# EAGLE schematic OBCv4.24 (EAGLE 9.6.2)

## Sheet 1 of 3
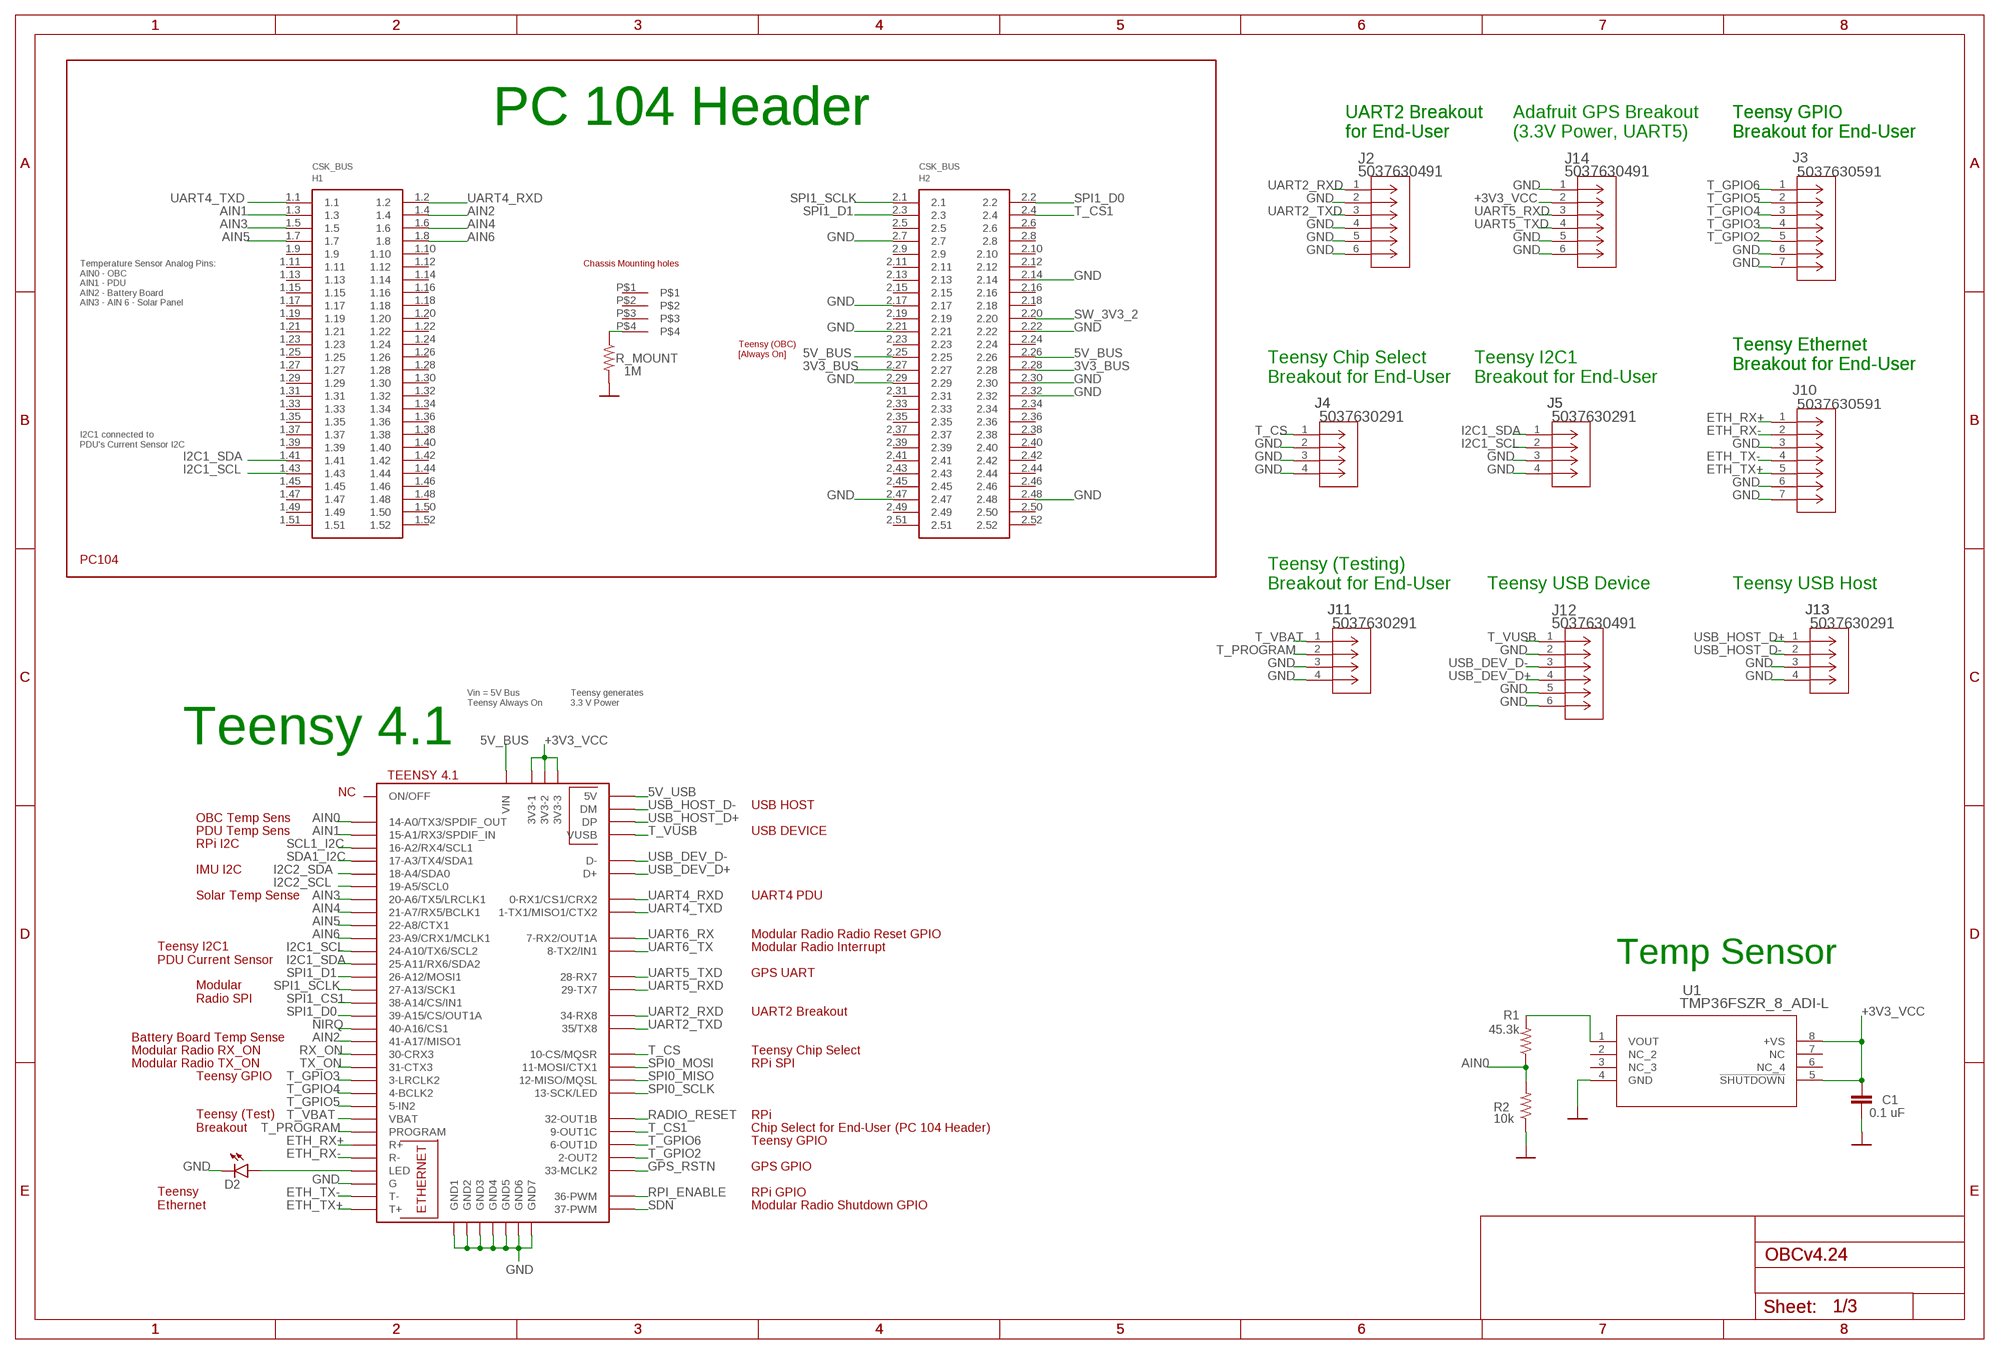
[diagram p0: schematic, sheet 1]

### Parts
C1  0.1 uF  CAP0805  [0805]
D2  LEDCHIP-LED0603  [CHIP-LED0603]
H1  PC104_WCONN  [PC104_WCONN]
J2  5037630491  [CON_5037630491]
J3  5037630591  [CON_5037630591]
J4  5037630291  [CON_5037630291]
J5  5037630291  [CON_5037630291]
J10  5037630591  [CON_5037630591]
J11  5037630291  [CON_5037630291]
J12  5037630491  [CON_5037630491]
J13  5037630291  [CON_5037630291]
J14  5037630491  [CON_5037630491]
R1  45.3k  RESISTOR0805-RES  [0805]
R2  10k  RESISTOR0805-RES  [0805]
R_MOUNT  1M  RESISTOR0805-RES  [0805]
U1  TMP36FSZR_8_ADI-L  [R_8_ADI-L]
U$1  TEENSY41TEENSY  [TEENSY41]

### Nets
3V3_BUS: H1.2.27 H1.2.28 ; also sheet 3
5V_BUS: H1.2.25 H1.2.26 U$1.VIN ; also sheet 2
5V_USB: U$1.+5V(5V)
+3V3_VCC: C1.1 J14.2 U1.5(!SHUTDOWN) U1.8(+VS) U$1.3V3-1 U$1.3V3-2 U$1.3V3-3 ; also sheet 3
AIN0: R1.1 R2.2 U$1.14-A0/TX3/SPDIF_OUT
AIN1: H1.1.3 U$1.15-A1/RX3/SPDIF_IN
AIN2: H1.1.4 U$1.41-A17/MISO1
AIN3: H1.1.5 U$1.20-A6/TX5/LRCLK1
AIN4: H1.1.6 U$1.21-A7/RX5/BCLK1
AIN5: H1.1.7 U$1.22-A8/CTX1
AIN6: H1.1.8 U$1.23-A9/CRX1/MCLK1
ETH_RX+: J10.1 U$1.R+
ETH_RX-: J10.2 U$1.R-
ETH_TX+: J10.5 U$1.T+
ETH_TX-: J10.4 U$1.T-
GND: C1.2 D2.C H1.2.7 H1.2.14 H1.2.17 H1.2.21 H1.2.22 H1.2.29 H1.2.30 H1.2.32 H1.2.47 H1.2.48 J2.2 J2.4 J2.5 J2.6 J3.6 J3.7 J4.2 J4.3 J4.4 J5.3 J5.4 J10.3 J10.6 J10.7 J11.3 J11.4 J12.2 J12.5 J12.6 J13.3 J13.4 J14.1 J14.5 J14.6 R2.1 R_MOUNT.2 U1.4(GND) U$1.G U$1.GND1 U$1.GND2 U$1.GND3 U$1.GND4 U$1.GND5 U$1.GND6 U$1.GND(GND7) ; also sheet 2,3
GPS_RSTN: U$1.33-MCLK2 ; also sheet 3
I2C1_SCL: H1.1.43 J5.2 U$1.24-A10/TX6/SCL2
I2C1_SDA: H1.1.41 J5.1 U$1.25-A11/RX6/SDA2
I2C2_SCL: U$1.19-A5/SCL0 ; also sheet 3
I2C2_SDA: U$1.18-A4/SDA0 ; also sheet 3
N$8: D2.A U$1.LED
N$15: R1.2 U1.1(VOUT)
N$94: H1.P$4 R_MOUNT.1
NIRQ: U$1.40-A16/CS1 ; also sheet 3
RADIO_RESET: U$1.32-OUT1B ; also sheet 3
RPI_ENABLE: U$1.36-PWM ; also sheet 2
RX_ON: U$1.30-CRX3 ; also sheet 3
SCL1_I2C: U$1.16-A2/RX4/SCL1 ; also sheet 2
SDA1_I2C: U$1.17-A3/TX4/SDA1 ; also sheet 2
SDN: U$1.37-PWM ; also sheet 3
SPI0_MISO: U$1.12-MISO/MQSL ; also sheet 2
SPI0_MOSI: U$1.11-MOSI/CTX1 ; also sheet 2
SPI0_SCLK: U$1.13-SCK/LED ; also sheet 2
SPI1_CS1: U$1.38-A14/CS/IN1 ; also sheet 3
SPI1_D0: H1.2.2 U$1.39-A15/CS/OUT1A ; also sheet 3
SPI1_D1: H1.2.3 U$1.26-A12/MOSI1 ; also sheet 3
SPI1_SCLK: H1.2.1 U$1.27-A13/SCK1 ; also sheet 3
SW_3V3_2: H1.2.20 ; also sheet 3
T_CS: J4.1 U$1.10-CS\MQSR(10-CS/MQSR)
T_CS1: H1.2.4 U$1.9-OUT1C
T_GPIO2: J3.5 U$1.2-OUT2
T_GPIO3: J3.4 U$1.3-LRCLK2
T_GPIO4: J3.3 U$1.4-BCLK2
T_GPIO5: J3.2 U$1.5-IN2
T_GPIO6: J3.1 U$1.6-OUT1D
T_PROGRAM: J11.2 U$1.PROGRAM
T_VBAT: J11.1 U$1.VBAT
T_VUSB: J12.1 U$1.VUSB
TX_ON: U$1.31-CTX3 ; also sheet 3
UART2_RXD: J2.1 U$1.34-RX8
UART2_TXD: J2.3 U$1.35-TX8(35/TX8)
UART4_RXD: H1.1.2 U$1.0-RX1/CS1/CRX2
UART4_TXD: H1.1.1 U$1.1-TX1/MISO1/CTX2
UART5_RXD: J14.3 U$1.29-TX7 ; also sheet 3
UART5_TXD: J14.4 U$1.28-RX7 ; also sheet 3
UART6_RX: U$1.7-RX2/OUT1A ; also sheet 2
UART6_TX: U$1.8-TX2/IN1 ; also sheet 2
USB_DEV_D+: J12.4 U$1.D+
USB_DEV_D-: J12.3 U$1.D-
USB_HOST_D+: J13.1 U$1.DP
USB_HOST_D-: J13.2 U$1.DM
Unconnected: H1.1.9 H1.1.10 H1.1.11 H1.1.12 H1.1.13 H1.1.14 H1.1.15 H1.1.16 H1.1.17 H1.1.18 H1.1.19 H1.1.20 H1.1.21 H1.1.22 H1.1.23 H1.1.24 H1.1.25 H1.1.26 H1.1.27 H1.1.28 H1.1.29 H1.1.30 H1.1.31 H1.1.32 H1.1.33 H1.1.34 H1.1.35 H1.1.36 H1.1.37 H1.1.38 H1.1.39 H1.1.40 H1.1.42 H1.1.44 H1.1.45 H1.1.46 H1.1.47 H1.1.48 H1.1.49 H1.1.50 H1.1.51 H1.1.52 H1.2.5 H1.2.6 H1.2.8 H1.2.9 H1.2.10 H1.2.11 H1.2.12 H1.2.13 H1.2.15 H1.2.16 H1.2.18 H1.2.19 H1.2.23 H1.2.24 H1.2.31 H1.2.33 H1.2.34 H1.2.35 H1.2.36 H1.2.37 H1.2.38 H1.2.39 H1.2.40 H1.2.41 H1.2.42 H1.2.43 H1.2.44 H1.2.45 H1.2.46 H1.2.49 H1.2.50 H1.2.51 H1.2.52 H1.P$1 H1.P$2 H1.P$3 U1.2(NC_2) U1.3(NC_3) U1.6(NC_4) U1.7(NC) U$1.ON/OFF

### Notes on the sheet
- PC 104 Header | PC 104 Header
- UART2 Breakout
  for End-User
- UART2 Breakout
  for End-User
- Adafruit GPS Breakout 
  (3.3V Power, UART5)
- Teensy GPIO
  Breakout for End-User
- Teensy GPIO
  Breakout for End-User
- Temperature Sensor Analog Pins:
  AIN0 - OBC
  AIN1 - PDU
  AIN2 - Battery Board
  AIN3 - AIN 6 - Solar Panel
- Teensy (OBC)
  [Always On]
- Teensy Ethernet
  Breakout for End-User
- Teensy Ethernet
  Breakout for End-User
- Teensy Chip Select
  Breakout for End-User
- Teensy I2C1 
  Breakout for End-User
- I2C1 connected to
  PDU's Current Sensor I2C
- Teensy (Testing)
  Breakout for End-User
- Teensy USB Device | Teensy USB Host
- Vin = 5V Bus 
  Teensy Always On
- Teensy generates 
  3.3 V Power
- Teensy 4.1
- NC
- USB HOST
- OBC Temp Sens
- PDU Temp Sens | USB DEVICE
- RPi I2C
- IMU I2C
- Solar Temp Sense | UART4 PDU
- Modular Radio Radio Reset GPIO
- Modular Radio Interrupt
- Teensy I2C1
  PDU Current Sensor
- Temp Sensor
- GPS UART
- Modular 
  Radio SPI
- UART2 Breakout
- Battery Board Temp Sense
- Modular Radio RX_ON | Teensy Chip Select
- Modular Radio TX_ON | RPi SPI
- Teensy GPIO
- RPi
- Teensy (Test)
  Breakout
- Chip Select for End-User (PC 104 Header)
- Teensy GPIO
- GPS GPIO
- RPi GPIO
- Teensy 
  Ethernet
- Modular Radio Shutdown GPIO

## Sheet 2 of 3
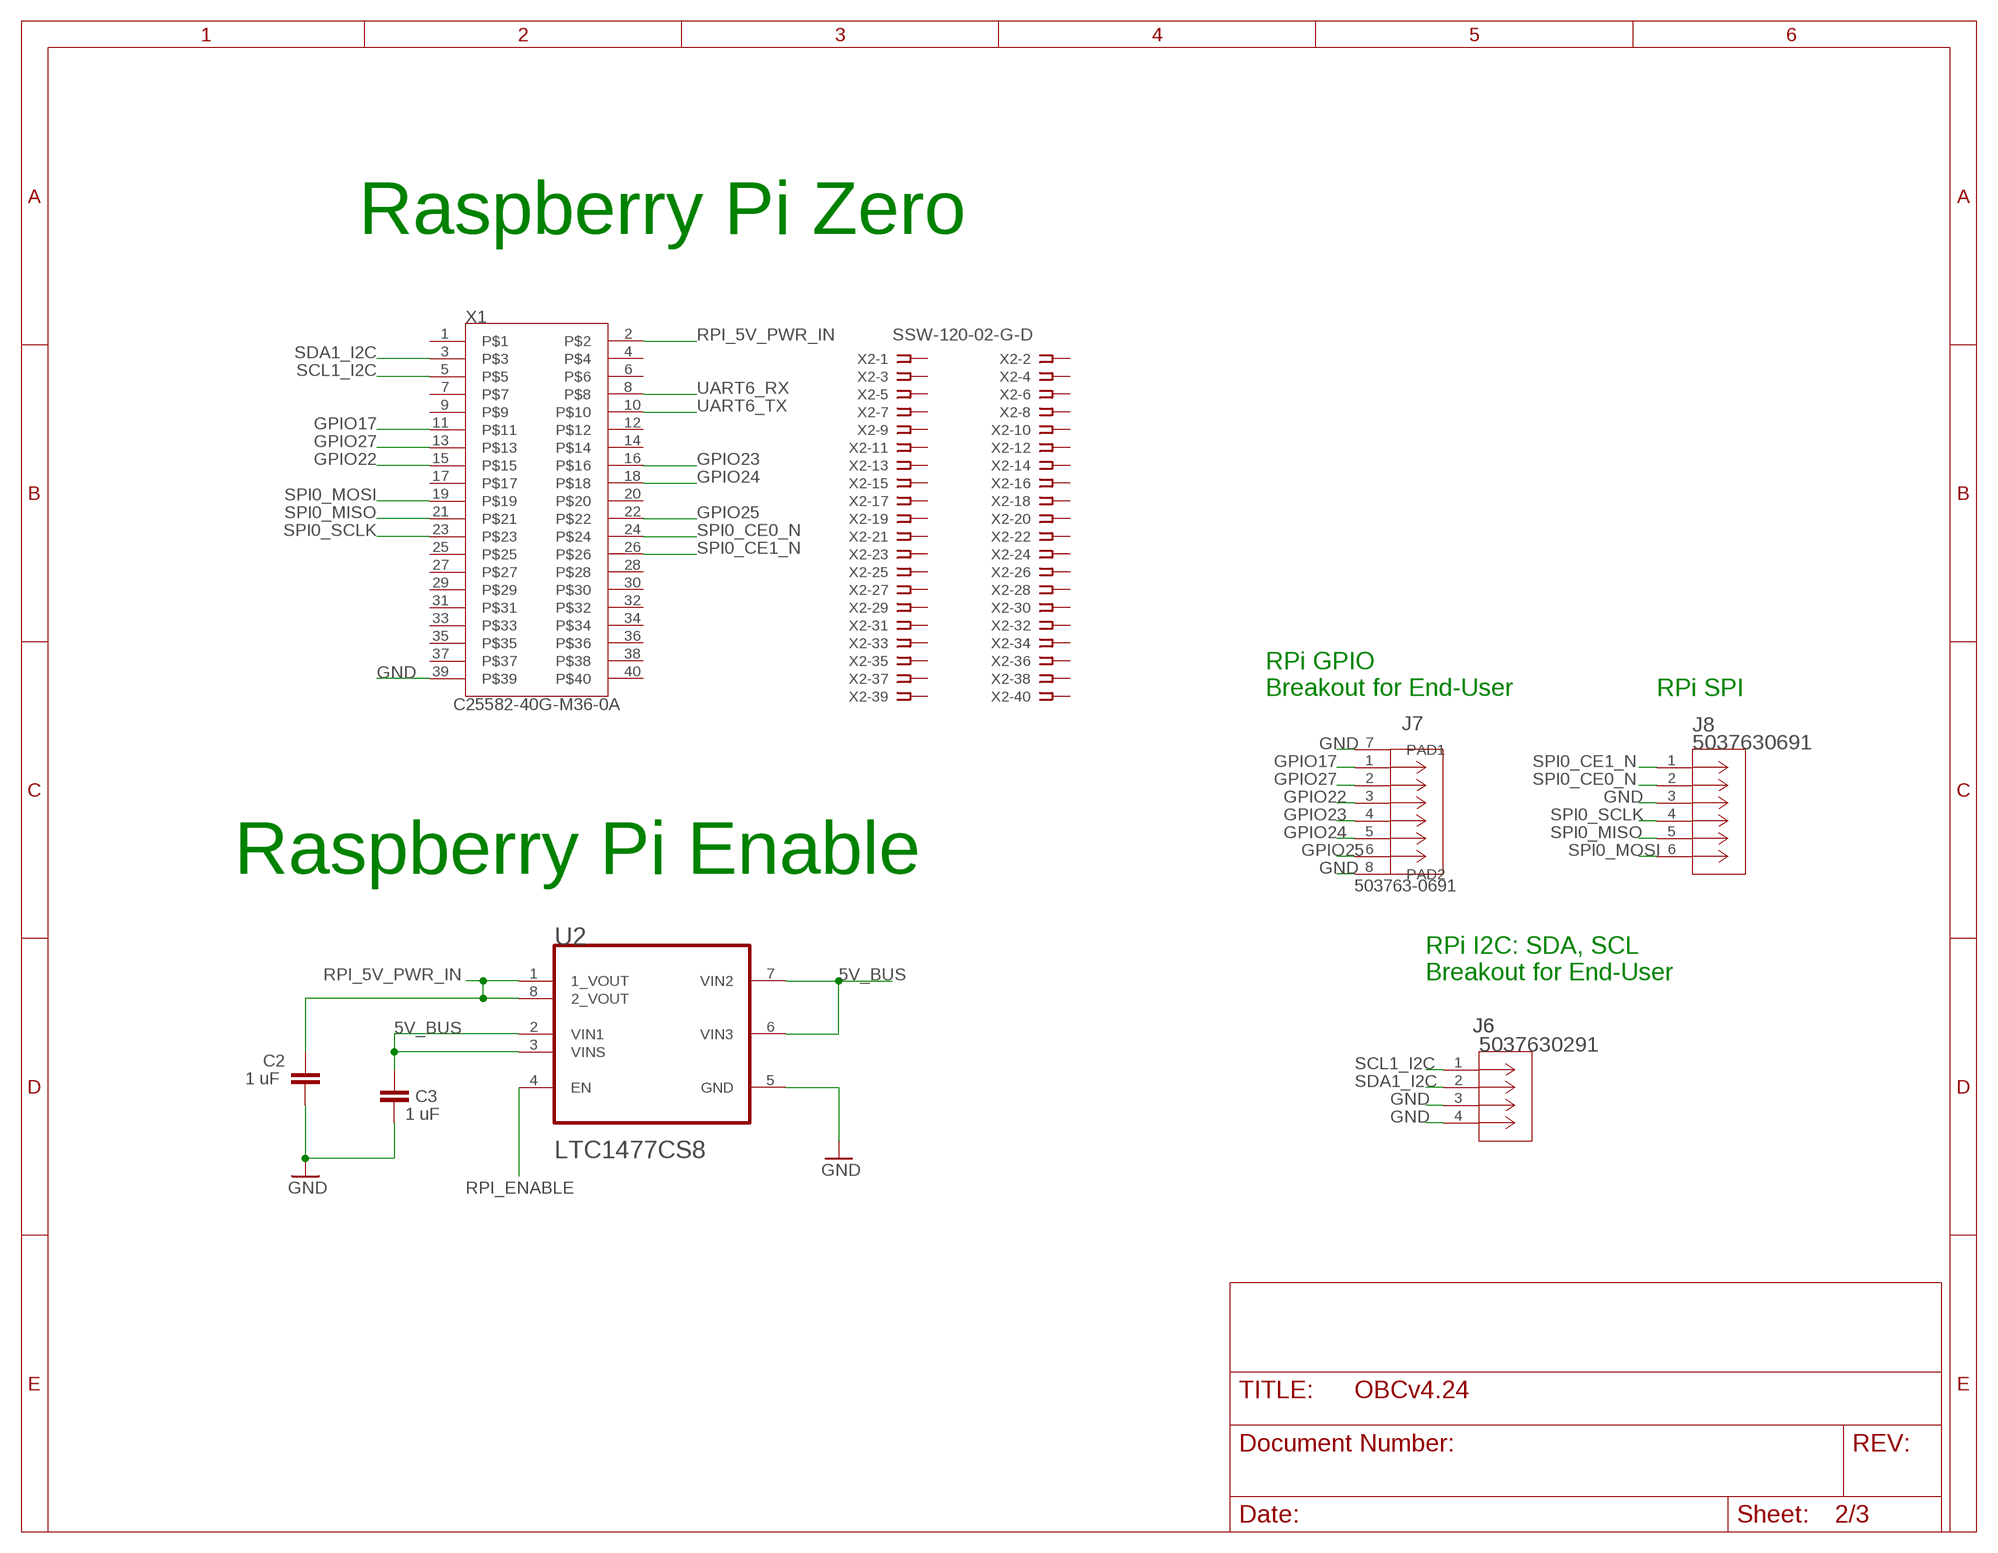
[diagram p1: schematic, sheet 2]

### Parts
C2  1 uF  CAP0805  [0805]
C3  1 uF  CAP0805  [0805]
J6  5037630291  [CON_5037630291]
J7  503763-0691  [CONN_503763-0691_MOL]
J8  5037630691  [CONN_503763-0691_MOL]
U2  LTC1477CS8LINEAR_TECHNOLOGY_LTC1477CS8_0_2  [LINEAR_TECHNOLOGY_LTC1477CS8_2]
X1  C25582-40G-M36-0A  [ADAFRUIT_C25582-40G-M36-0A_0]
X2  SSW-120-02-G-D  [SSW-120-02-G-D]

### Nets
5V_BUS: C3.1 U2.2(VIN1) U2.3(VINS) U2.6(VIN3) U2.7(VIN2) ; also sheet 1
GND: C2.2 C3.2 J6.3 J6.4 J7.7(PAD1) J7.8(PAD2) J8.3 U2.5(GND) X1.39 ; also sheet 1,3
GPIO17: J7.1 X1.11
GPIO22: J7.3 X1.15
GPIO23: J7.4 X1.16
GPIO24: J7.5 X1.18
GPIO25: J7.6 X1.22
GPIO27: J7.2 X1.13
RPI_5V_PWR_IN: C2.1 U2.1(1_VOUT) U2.8(2_VOUT) X1.2
RPI_ENABLE: U2.4(EN) ; also sheet 1
SCL1_I2C: J6.1 X1.5 ; also sheet 1
SDA1_I2C: J6.2 X1.3 ; also sheet 1
SPI0_CE0_N: J8.2 X1.24
SPI0_CE1_N: J8.1 X1.26
SPI0_MISO: J8.5 X1.21 ; also sheet 1
SPI0_MOSI: J8.6 X1.19 ; also sheet 1
SPI0_SCLK: J8.4 X1.23 ; also sheet 1
UART6_RX: X1.8 ; also sheet 1
UART6_TX: X1.10 ; also sheet 1
Unconnected: X1.1 X1.4 X1.6 X1.7 X1.9 X1.12 X1.14 X1.17 X1.20 X1.25 X1.27 X1.28 X1.29 X1.30 X1.31 X1.32 X1.33 X1.34 X1.35 X1.36 X1.37 X1.38 X1.40 X2.1 X2.2 X2.3 X2.4 X2.5 X2.6 X2.7 X2.8 X2.9 X2.10 X2.11 X2.12 X2.13 X2.14 X2.15 X2.16 X2.17 X2.18 X2.19 X2.20 X2.21 X2.22 X2.23 X2.24 X2.25 X2.26 X2.27 X2.28 X2.29 X2.30 X2.31 X2.32 X2.33 X2.34 X2.35 X2.36 X2.37 X2.38 X2.39 X2.40

### Notes on the sheet
- Raspberry Pi Zero
- RPi GPIO
  Breakout for End-User
- RPi SPI
- Raspberry Pi Enable
- RPi I2C: SDA, SCL 
  Breakout for End-User

## Sheet 3 of 3
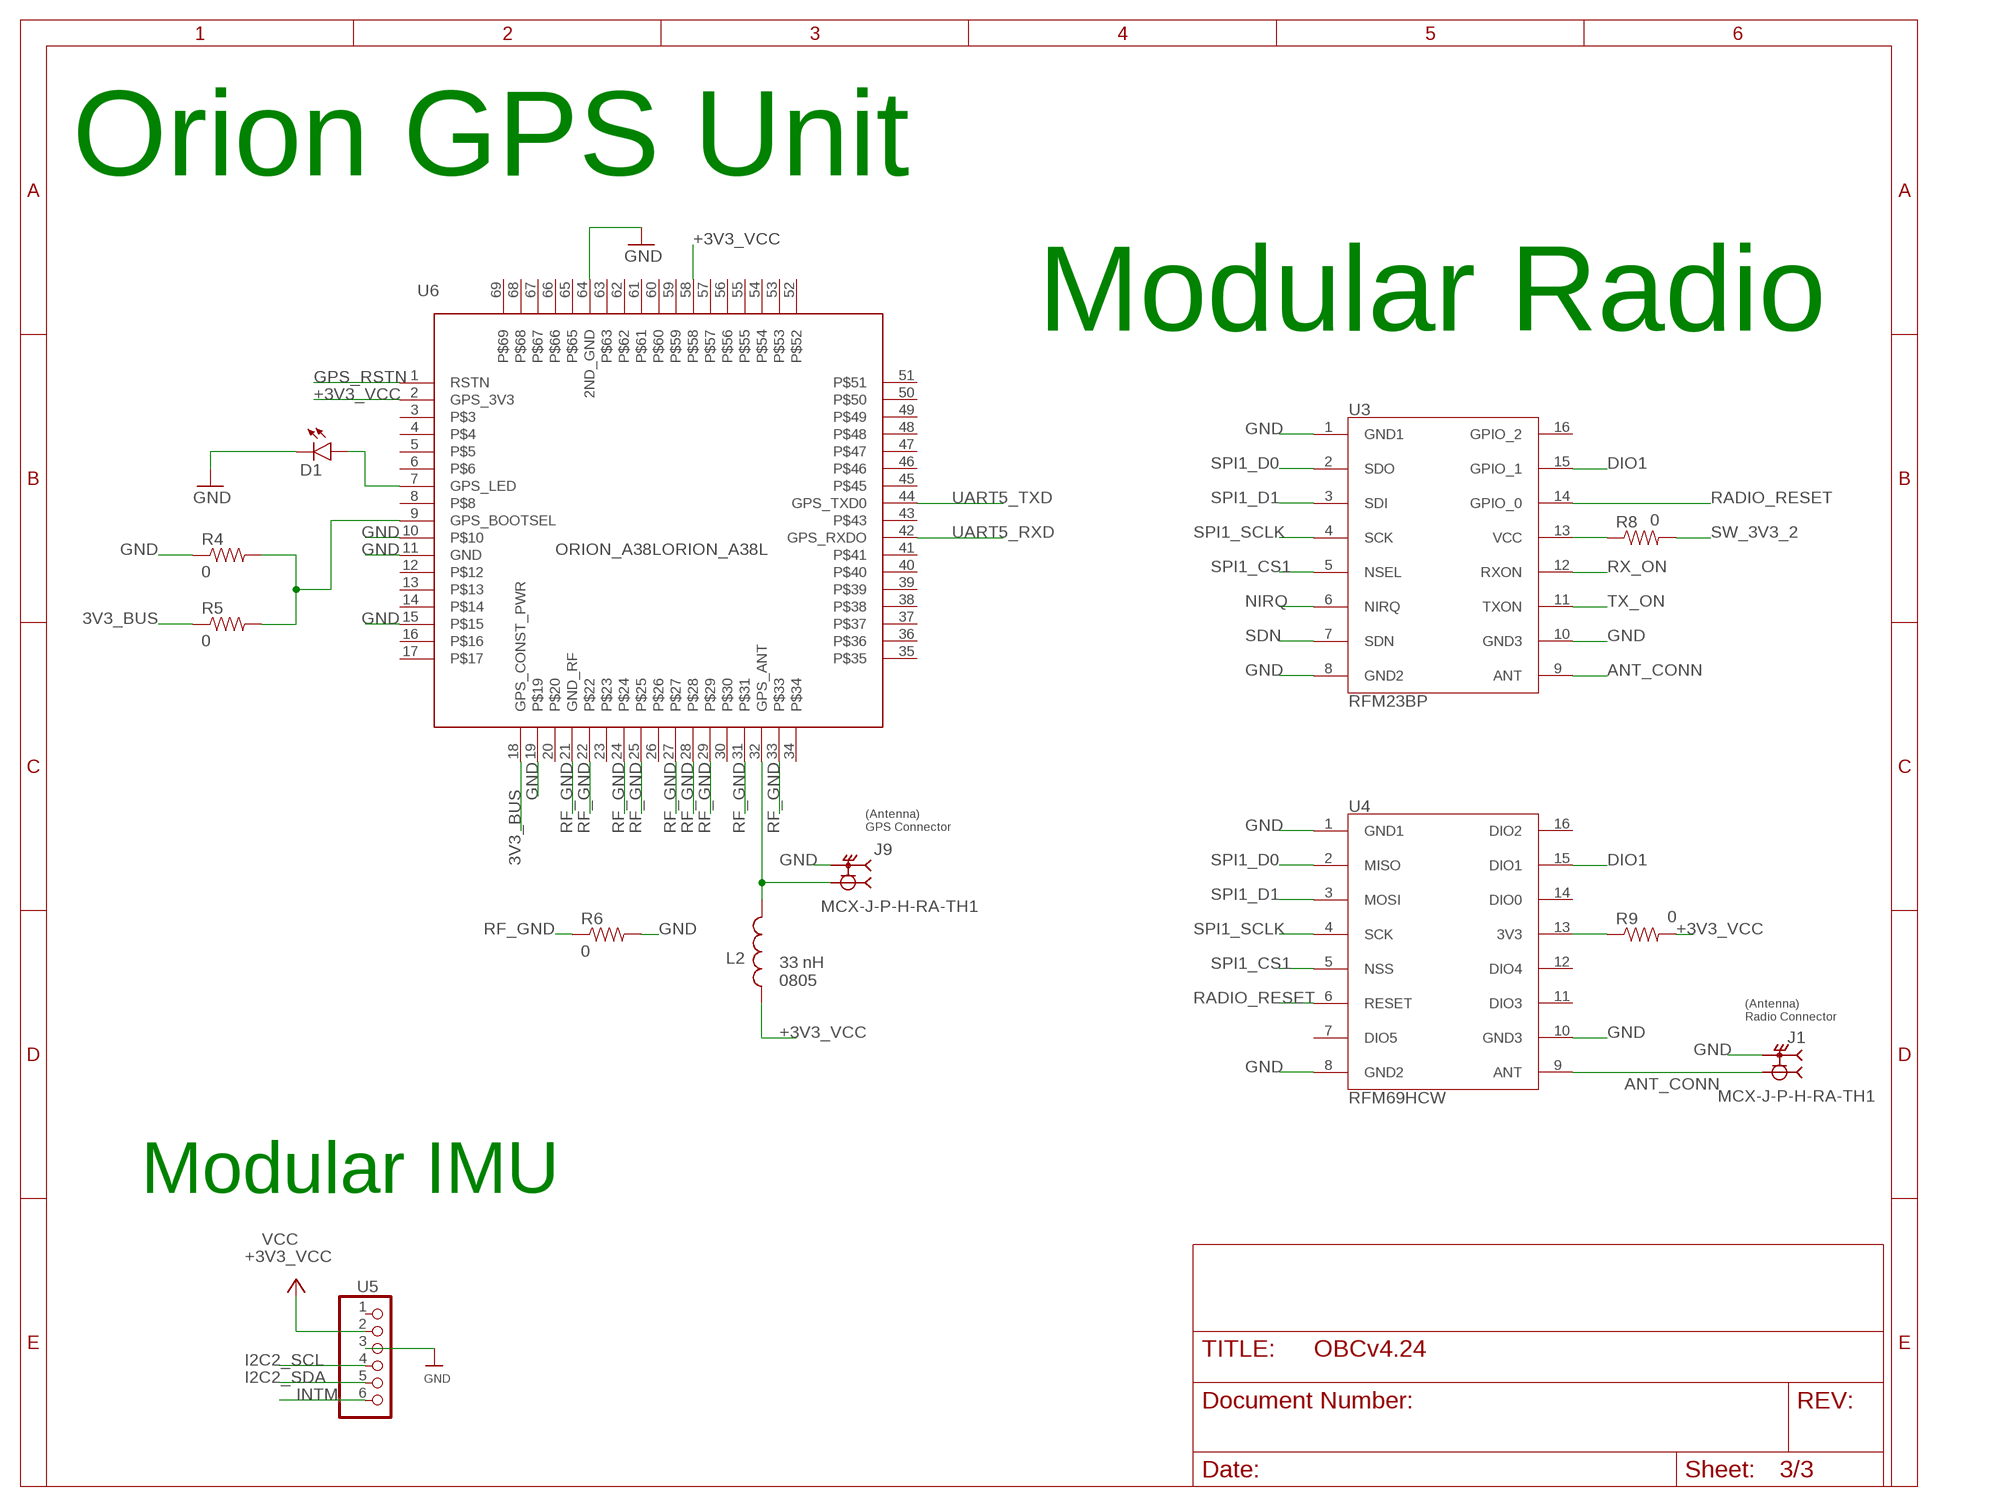
[diagram p2: schematic, sheet 3]

### Parts
D1  LEDCHIP-LED0603  [CHIP-LED0603]
J1  MCX-J-P-H-RA-TH1  [SAMTEC_MCX-J-P-H-RA-TH1]
J9  MCX-J-P-H-RA-TH1  [SAMTEC_MCX-J-P-H-RA-TH1]
L2  AIMC-0805-2N2S-T  [INDC2012X105N]
R4  0  RESISTOR0805-RES  [0805]
R5  0  RESISTOR0805-RES  [0805]
R6  0  RESISTOR0805-RES  [0805]
R8  0  RESISTOR2512  [R2512]
R9  0  RESISTOR2512  [R2512]
U3  RFM23BP  [RFM23BP]
U4  RFM69HCW  [RFM69HCW]
U5  HEADER-1X670MIL  [1X06_ROUND_70]
U6  ORION_A38LORION_A38L  [ORION_A38L]

### Nets
3V3_BUS: R5.1 U6.18(GPS_CONST_PWR) ; also sheet 1
+3V3_VCC: L2.1 R9.2 U5.2 U6.2(GPS_3V3) U6.58 ; supply symbol labelled VCC ; also sheet 1
ANT_CONN: J1.1 U3.9(ANT) U4.9(ANT)
DIO1: U3.15(GPIO_1) U4.15(DIO1)
GND: D1.C J1.S1 J1.S2 J1.S3 J1.S4 J9.S1 J9.S2 J9.S3 J9.S4 R4.1 R6.2 U3.1(GND1) U3.8(GND2) U3.10(GND3) U4.1(GND1) U4.8(GND2) U4.10(GND3) U5.3 U6.10 U6.11(GND) U6.15 U6.19 U6.64(2ND_GND) ; also sheet 1,2
GPS_RSTN: U6.1(RSTN) ; also sheet 1
I2C2_SCL: U5.4 ; also sheet 1
I2C2_SDA: U5.5 ; also sheet 1
INTM: U5.6
N$9: R8.1 U3.13(VCC)
N$10: R9.1 U4.13(3V3)
N$16: R4.2 R5.2 U6.9(GPS_BOOTSEL)
N$17: J9.1 L2.2 U6.32(GPS_ANT)
N$21: D1.A U6.7(GPS_LED)
NIRQ: U3.6(NIRQ) ; also sheet 1
RADIO_RESET: U3.14(GPIO_0) U4.6(RESET) ; also sheet 1
RF_GND: R6.1 U6.21(GND_RF) U6.22 U6.24 U6.25 U6.27 U6.28 U6.29 U6.31 U6.33
RX_ON: U3.12(RXON) ; also sheet 1
SDN: U3.7(SDN) ; also sheet 1
SPI1_CS1: U3.5(NSEL) U4.5(NSS) ; also sheet 1
SPI1_D0: U3.2(SDO) U4.2(MISO) ; also sheet 1
SPI1_D1: U3.3(SDI) U4.3(MOSI) ; also sheet 1
SPI1_SCLK: U3.4(SCK) U4.4(SCK) ; also sheet 1
SW_3V3_2: R8.2 ; also sheet 1
TX_ON: U3.11(TXON) ; also sheet 1
UART5_RXD: U6.42(GPS_RXDO) ; also sheet 1
UART5_TXD: U6.44(GPS_TXD0) ; also sheet 1
Unconnected: U3.16(GPIO_2) U4.7(DIO5) U4.11(DIO3) U4.12(DIO4) U4.14(DIO0) U4.16(DIO2) U5.1 U6.3 U6.4 U6.5 U6.6 U6.8 U6.12 U6.13 U6.14 U6.16 U6.17 U6.20 U6.23 U6.26 U6.30 U6.34 U6.35 U6.36 U6.37 U6.38 U6.39 U6.40 U6.41 U6.43 U6.45 U6.46 U6.47 U6.48 U6.49 U6.50 U6.51 U6.52 U6.53 U6.54 U6.55 U6.56 U6.57 U6.59 U6.60 U6.61 U6.62 U6.63 U6.65 U6.66 U6.67 U6.68 U6.69

### Notes on the sheet
- Orion GPS Unit
- Modular Radio
- (Antenna)
  GPS Connector
- 33 nH
  0805
- (Antenna)
  Radio Connector
- Modular IMU

## Library data of the parts
C1-C3 = HSFL_Main_Library:CAP: Capacitor Standard 0603 ceramic capacitor, and 0.1" leaded capacitor.
D1 D2 = led:LED: LED OSRAM: - CHIPLED LG R971, LG N971, LY N971, LG Q971, LY Q971, LO R971, LY R971 LH N974, LH R974 LS Q976, LO Q976, LY Q976 LO Q996 - Hyper CHIPLED LW Q18S LB Q993, LB Q99A, LB R99A - SideLED LS A670, LO A670, LY A670, LG A670, LP A670 LB A673, LV A673, LT A673, LW A673 LH A674 LY A675 LS A676, LA A676, LO A676, LY A676, LW A676 LS A679, LY A679, LG A679 - Hyper Micro SIDELED® LS Y876, LA Y876, LO Y876, LY Y876 LT Y87S - SmartLED LW L88C, LW L88S LB L89C, LB L89S, LG L890 LS L89K, LO L89K, LY L89K LS L896, LA L896, LO L896, LY L896 - TOPLED LS T670, LO T670, LY T670, LG T670, LP T670 LSG T670, LSP T670, LSY T670, LOP T670, LYG T670 LG T671, LOG T671, LSG T671 LB T673, LV T673, LT T673, LW T673 LH T674 LS T676, LA T676, LO T676, LY T676, LB T676, LH T676, LSB T676, LW T676 LB T67C, LV T67C, LT T67C, LS T67K, LO T67K, LY T67K, LW E67C LS E67B, LA E67B, LO E67B, LY E67B, LB E67C, LV E67C, LT E67C LW T67C LS T679, LY T679, LG T679 LS T770, LO T770, LY T770, LG T770, LP T770 LB T773, LV T773, LT T773, LW T773 LH T774 LS E675, LA E675, LY E675, LS T675 LS T776, LA T776, LO T776, LY T776, LB T776 LHGB T686 LT T68C, LB T68C - Hyper Mini TOPLED® LB M676 - Mini TOPLED Santana® LG M470 LS M47K, LO M47K, LY M47K Source: http://www.osram.convergy.de LUXEON: - LUMILED® LXK2-PW12-R00, LXK2-PW12-S00, LXK2-PW14-U00, LXK2-PW14-V00 LXK2-PM12-R00, LXK2-PM12-S00, LXK2-PM14-U00 LXK2-PE12-Q00, LXK2-PE12-R00, LXK2-PE12-S00, LXK2-PE14-T00, LXK2-PE14-U00 LXK2-PB12-K00, LXK2-PB12-L00, LXK2-PB12-M00, LXK2-PB14-N00, LXK2-PB14-P00, LXK2-PB14-Q00 LXK2-PR12-L00, LXK2-PR12-M00, LXK2-PR14-Q00, LXK2-PR14-R00 LXK2-PD12-Q00, LXK2-PD12-R00, LXK2-PD12-S00 LXK2-PH12-R00, LXK2-PH12-S00 LXK2-PL12-P00, LXK2-PL12-Q00, LXK2-PL12-R00 Source: www.luxeon.com KINGBRIGHT: KA-3528ASYC Source: www.kingbright.com
H1 = HSFL_Main_Library:PC104_WCONN
J1 J9 = OBCv4:MCX-J-P-H-RA-TH1: 50 Ohm MCX Jack or Plug, Through-hole; DESCRIPTION: MCX Connector Jack, Female Socket 50Ohm Through Hole, Right Angle Solder; DIGI-KEY_PART_NUMBER: SAM10607-ND; MF: Samtec; MP: MCX-J-P-H-RA-TH1; PACKAGE: None; PURCHASE-URL: https://pricing.snapeda.com/search/part/MCX-J-P-H-RA-TH1/?ref=eda
J2 J12 J14 = OBCv4:5037630491; BUILT_BY: Molex_Team; COPYRIGHT: Copyright (C) 2018 Accelerated Designs. All rights reserved; MANUFACTURER_PART_NUMBER: 5037630491; SOURCELIBRARY: Add_to_database_2021-03-17; VENDOR: Molex Connector Corporation
J3 J10 = OBCv4:5037630591; COPYRIGHT: Copyright (C) 2021 Ultra Librarian. All rights reserved.; MANUFACTURER_PART_NUMBER: 5037630591; MFR_NAME: Molex Connector Corporation
J4-J6 J11 J13 = OBCv4:5037630291; BUILT_BY: Molex_Team; COPYRIGHT: Copyright (C) 2018 Accelerated Designs. All rights reserved; MANUFACTURER_PART_NUMBER: 5037630291; SOURCELIBRARY: Add_to_database_2021-03-17; VENDOR: Molex Connector Corporation
J7 = Improved Molex 503763-0691:503763-0691; BUILT_BY: EMA_Cory; COPYRIGHT: Copyright (C) 2018 Accelerated Designs. All rights reserved; DATASHEET: https://www.digikey.com/products/en?keywords=503763-0691; MANUFACTURER_PART_NUMBER: 503763-0691; SOURCELIBRARY: Molex_2020-01-22; VENDOR: Molex Connector Corporation
J8 = OBCv4:5037630691; BUILT_BY: EMA_Cory; COPYRIGHT: Copyright (C) 2018 Accelerated Designs. All rights reserved; DATASHEET: https://www.digikey.com/products/en?keywords=503763-0691; MANUFACTURER_PART_NUMBER: 503763-0691; SOURCELIBRARY: Molex_2020-01-22; VENDOR: Molex Connector Corporation
L2 = PDU:AIMC-0805-2N2S-T: 2.2nH Unshielded Multilayer Inductor 600mA 100mOhm Max 0805 (2012 Metric); DESCRIPTION: IND 2.2nH 0.3A 100mΩ; DIGI-KEY_PART_NUMBER: 535-11562-1-ND; MF: Abracon; MP: AIMC-0805-2N2S-T; PACKAGE: 2012 Bourns
R1 R2 R4-R6 R8 R9 R_MOUNT = HSFL_Main_Library:RESISTOR: Resistor Basic schematic elements and footprints for 0603, 1206, and PTH resistors.
U1 = TMP36FSZR_8:TMP36FSZ; COPYRIGHT: Copyright (C) 2021 Ultra Librarian. All rights reserved.; MANUFACTURER_PART_NUMBER: TMP36FSZ; MFR_NAME: Analog Devices Inc
U2 = Artemis:LTC1477CS8: LT-LTC1477-S8-8; CIIVA_IDS: 1432281; COMPONENT_LINK_1_DESCRIPTION: Manufacturer URL; COMPONENT_LINK_1_URL: http://www.linear.com/; COMPONENT_LINK_3_DESCRIPTION: Package Specification; COMPONENT_LINK_3_URL: http://cds.linear.com/docs/en/packaging/05081610_G_SO8.pdf; DATASHEET: http://cds.linear.com/docs/en/datasheet/lt1477.pdf; FOOTPRINT_VARIANT_NAME_0: Level C; FOOTPRINT_VARIANT_NAME_1: Level B; FOOTPRINT_VARIANT_NAME_2: Level A; IMPORTED: yes; IMPORTED_FROM: vault; IMPORT_TS: 1521843574; MF: Linear Technology; MOUNTING_TECHNOLOGY: Surface Mount; MPN: LTC1477CS8; PACKAGE: S8-8; PACKAGE_DESCRIPTION: 8-Pin Plastic Small Outline (Narrow .150 Inch), Body 4.9 x 3.9 mm, Pitch 1.27 mm; PACKAGE_VERSION: Rev. G, 03/2012; PREFIX: U; RELEASE_DATE: 1377817843; ROHS: No; VAULT_GUID: 635B2D7C-EC07-409E-A57F-666E02CD64AC; VAULT_REVISION: 6B8B57C2-2CB3-4970-A31A-1EB58B636423
U3 = RFM RADIOS:RFM23BP
U4 = RFM RADIOS:RFM69HCW
U5 = microbuilder:HEADER-1X6: PIN HEADER
U6 = Artemis:ORION_A38L
U$1 = OBCv4:TEENSY41
X1 = Adafruit - C25582-40G-M36-0A:C25582-40G-M36-0A
X2 = con-samtec-edited:SSW-120-02-G: THROUGH-HOLE .025" SQ POST SOCKET Source: Samtec SSW.pdf; MF: Samtec Inc.; MPN: SSW-120-02-G-D; OC_FARNELL: unknown; OC_NEWARK: 11P9639

## Net classes
1 highpower: width 0.406 mm, drill 0.483 mm
2 lowpower: width 0.305 mm, drill 0.483 mm